# EAGLE design Pure Keys aec-pcb3-smd-Vertical-inProgress (EAGLE 9.1.1)

## Sheet 1 of 7: ATMEGA328P
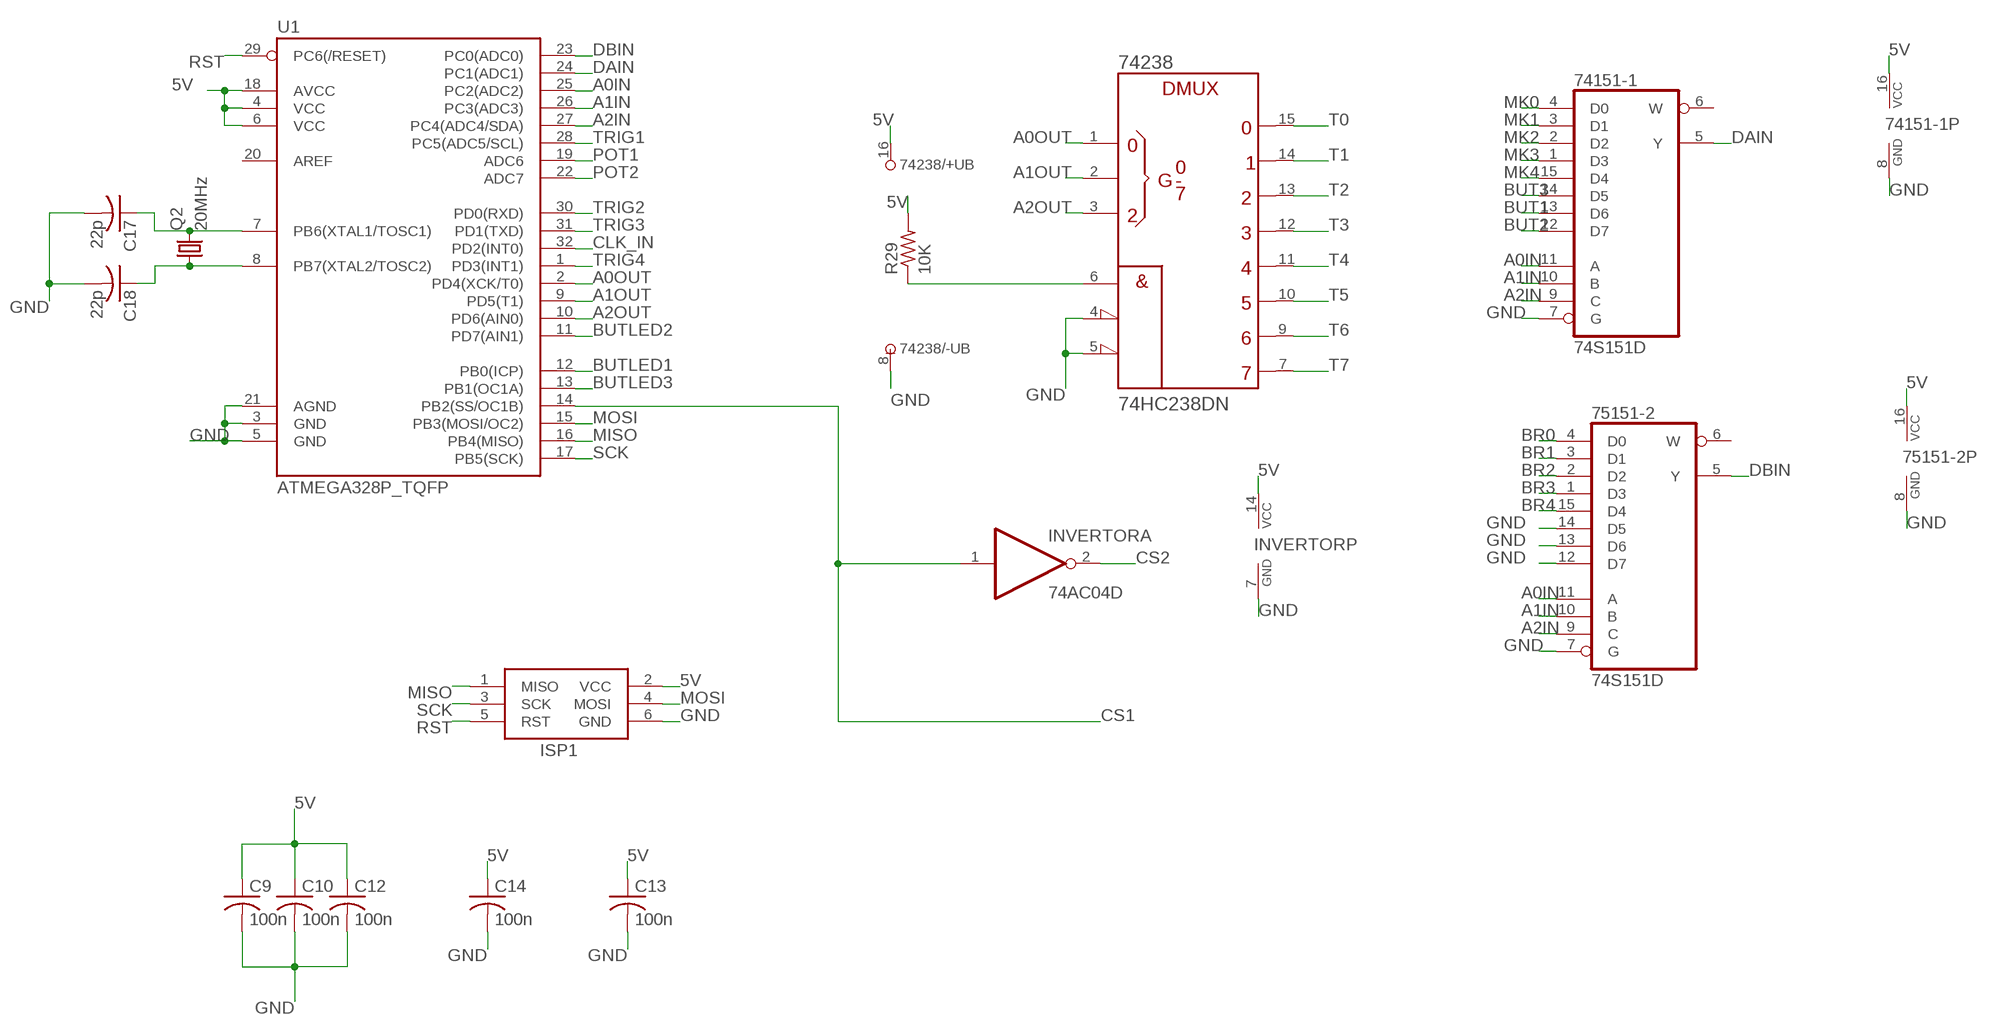
[diagram p0: schematic, sheet 1]

### Parts
74151-1  74S151D  [SO16]
74238  74HC238DN  [SO16]
75151-2  74S151D  [SO16]
C9  100n  C-USC0805K  [C0805K]
C10  100n  C-USC0805K  [C0805K]
C12  100n  C-USC0805K  [C0805K]
C13  100n  C-USC0805K  [C0805K]
C14  100n  C-USC0805K  [C0805K]
C17  22p  C-USC0805K  [C0805K]
C18  22p  C-USC0805K  [C0805K]
INVERTOR  74AC04D  [SO14]
ISP1  AVRISP-6  [AVRISP]
Q2  20MHz  CRYSTALHC49UP  [HC49UP]
R29  10K  R-US_R0805  [R0805]
U1  ATMEGA328P_TQFP  [TQFP32-08]

### Nets
5V [Power]: 74151-1.16(VCC) 74238.16(+UB) 75151-2.16(VCC) C9.1 C10.1 C12.1 C13.1 C14.1 INVERTOR.14(P:VCC) ISP1.2(VCC) R29.2 U1.4(VCC) U1.6(VCC) U1.18(AVCC) ; also sheet 2,4,5,6,7
A0IN: 74151-1.11(A) 75151-2.11(A) U1.25(PC2(ADC2))
A0OUT: 74238.1(A) U1.2(PD4(XCK/T0))
A1IN: 74151-1.10(B) 75151-2.10(B) U1.26(PC3(ADC3))
A1OUT: 74238.2(B) U1.9(PD5(T1))
A2IN: 74151-1.9(C) 75151-2.9(C) U1.27(PC4(ADC4/SDA))
A2OUT: 74238.3(C) U1.10(PD6(AIN0))
BR0: 75151-2.4(D0) ; also sheet 3
BR1: 75151-2.3(D1) ; also sheet 3
BR2: 75151-2.2(D2) ; also sheet 3
BR3: 75151-2.1(D3) ; also sheet 3
BR4: 75151-2.15(D4) ; also sheet 3
BUT1: 74151-1.13(D6) ; also sheet 6
BUT2: 74151-1.12(D7) ; also sheet 6
BUT3: 74151-1.14(D5) ; also sheet 6
BUTLED1: U1.12(PB0(ICP)) ; also sheet 6
BUTLED2: U1.11(PD7(AIN1)) ; also sheet 6
BUTLED3: U1.13(PB1(OC1A)) ; also sheet 6
CLK_IN: U1.32(PD2(INT0)) ; also sheet 7
CS1: INVERTOR.1(A:I) U1.14(PB2(SS/OC1B)) ; also sheet 5
CS2: INVERTOR.2(A:O) ; also sheet 5
DAIN: 74151-1.5(Y) U1.24(PC1(ADC1))
DBIN: 75151-2.5(Y) U1.23(PC0(ADC0))
ENOUT1: 74238.6(G1) R29.1
GND [Power]: 74151-1.7(G) 74151-1.8(GND) 74238.4(!G2A) 74238.5(!G2B) 74238.8(-UB) 75151-2.7(G) 75151-2.8(GND) 75151-2.12(D7) 75151-2.13(D6) 75151-2.14(D5) C9.2 C10.2 C12.2 C13.2 C14.2 C17.2 C18.2 INVERTOR.7(P:GND) ISP1.6(GND) U1.3(GND) U1.5(GND) U1.21(AGND) ; also sheet 2,3,4,5,6,7
MISO: ISP1.1(MISO) U1.16(PB4(MISO))
MK0: 74151-1.4(D0) ; also sheet 3
MK1: 74151-1.3(D1) ; also sheet 3
MK2: 74151-1.2(D2) ; also sheet 3
MK3: 74151-1.1(D3) ; also sheet 3
MK4: 74151-1.15(D4) ; also sheet 3
MOSI: ISP1.4(MOSI) U1.15(PB3(MOSI/OC2)) ; also sheet 5
N$10: C17.1 Q2.2 U1.7(PB6(XTAL1/TOSC1))
N$11: C18.1 Q2.1 U1.8(PB7(XTAL2/TOSC2))
POT1: U1.19(ADC6) ; also sheet 6
POT2: U1.22(ADC7) ; also sheet 6
RST: ISP1.5(RST) U1.29(PC6(/RESET))
SCK: ISP1.3(SCK) U1.17(PB5(SCK)) ; also sheet 5
T0: 74238.15(Y0) ; also sheet 3
T1: 74238.14(Y1) ; also sheet 3
T2: 74238.13(Y2) ; also sheet 3
T3: 74238.12(Y3) ; also sheet 3
T4: 74238.11(Y4) ; also sheet 3
T5: 74238.10(Y5) ; also sheet 3
T6: 74238.9(Y6) ; also sheet 3
T7: 74238.7(Y7) ; also sheet 3
TRIG1: U1.28(PC5(ADC5/SCL)) ; also sheet 4
TRIG2: U1.30(PD0(RXD)) ; also sheet 4
TRIG3: U1.31(PD1(TXD)) ; also sheet 4
TRIG4: U1.1(PD3(INT1)) ; also sheet 4
Unconnected: 74151-1.6(W) 75151-2.6(W) INVERTOR.3(B:I) INVERTOR.4(B:O) INVERTOR.5(C:I) INVERTOR.6(C:O) INVERTOR.8(D:O) INVERTOR.9(D:I) INVERTOR.10(E:O) INVERTOR.11(E:I) INVERTOR.12(F:O) INVERTOR.13(F:I) U1.20(AREF)

## Sheet 2 of 7: Power
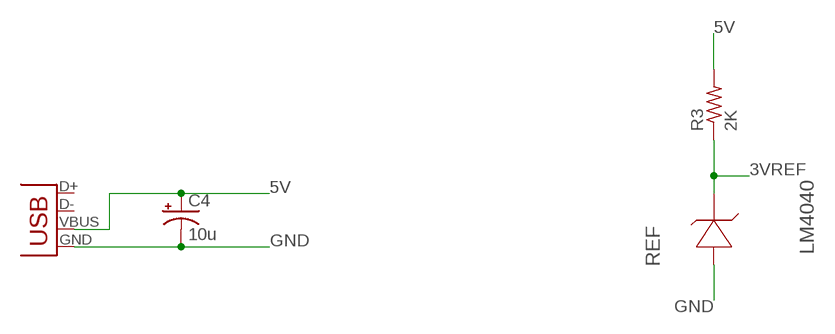
[diagram p1: schematic, sheet 2]

### Parts
C4  10u  CPOL-US153CLV-0505  [153CLV-0505]
JP2  USB-B  USBPTH  [USB-B-PTH]
R3  2K  R-US_R0805  [R0805]
REF  LM4040  LM4040A30IDBZT  [SOT95P237X112-3N]

### Nets
3VREF: R3.1 REF.1(CATHODE) ; also sheet 5
5V [Power]: C4.+ JP2.VBUS R3.2 ; also sheet 1,4,5,6,7
GND [Power]: C4.- JP2.GND REF.2(ANODE) ; also sheet 1,3,4,5,6,7
Unconnected: JP2.D+ JP2.D- REF.3(NC)

## Sheet 3 of 7: Keyboard Connector
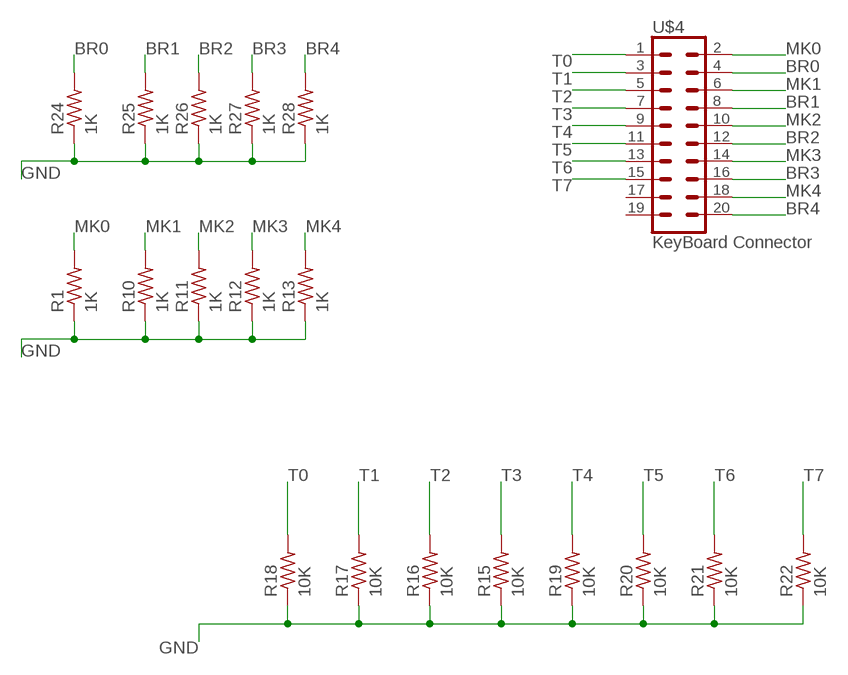
[diagram p2: schematic, sheet 3]

### Parts
R1  1K  R-US_R0805  [R0805]
R10  1K  R-US_R0805  [R0805]
R11  1K  R-US_R0805  [R0805]
R12  1K  R-US_R0805  [R0805]
R13  1K  R-US_R0805  [R0805]
R15  10K  R-US_R0805  [R0805]
R16  10K  R-US_R0805  [R0805]
R17  10K  R-US_R0805  [R0805]
R18  10K  R-US_R0805  [R0805]
R19  10K  R-US_R0805  [R0805]
R20  10K  R-US_R0805  [R0805]
R21  10K  R-US_R0805  [R0805]
R22  10K  R-US_R0805  [R0805]
R24  1K  R-US_R0805  [R0805]
R25  1K  R-US_R0805  [R0805]
R26  1K  R-US_R0805  [R0805]
R27  1K  R-US_R0805  [R0805]
R28  1K  R-US_R0805  [R0805]
U$4  KeyBoard Connector  CONN_10X2  [2X10]

### Nets
BR0: R24.2 U$4.4 ; also sheet 1
BR1: R25.2 U$4.8 ; also sheet 1
BR2: R26.2 U$4.12 ; also sheet 1
BR3: R27.2 U$4.16 ; also sheet 1
BR4: R28.2 U$4.20 ; also sheet 1
GND [Power]: R1.1 R10.1 R11.1 R12.1 R13.1 R15.1 R16.1 R17.1 R18.1 R19.1 R20.1 R21.1 R22.1 R24.1 R25.1 R26.1 R27.1 R28.1 ; also sheet 1,2,4,5,6,7
MK0: R1.2 U$4.2 ; also sheet 1
MK1: R10.2 U$4.6 ; also sheet 1
MK2: R11.2 U$4.10 ; also sheet 1
MK3: R12.2 U$4.14 ; also sheet 1
MK4: R13.2 U$4.18 ; also sheet 1
T0: R18.2 U$4.1 ; also sheet 1
T1: R17.2 U$4.3 ; also sheet 1
T2: R16.2 U$4.5 ; also sheet 1
T3: R15.2 U$4.7 ; also sheet 1
T4: R19.2 U$4.9 ; also sheet 1
T5: R20.2 U$4.11 ; also sheet 1
T6: R21.2 U$4.13 ; also sheet 1
T7: R22.2 U$4.15 ; also sheet 1
Unconnected: U$4.17 U$4.19

## Sheet 4 of 7: Triggers
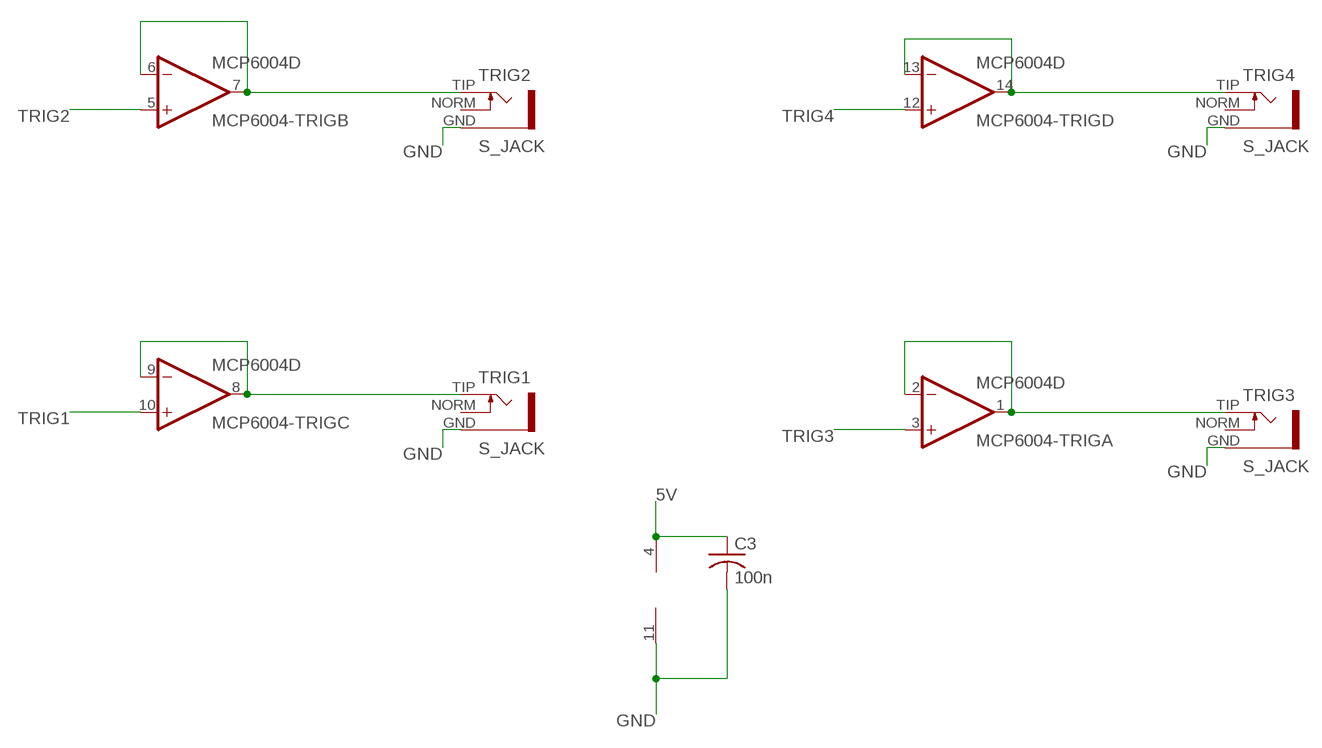
[diagram p3: schematic, sheet 4]

### Parts
C3  100n  C-USC0805K  [C0805K]
MCP6004-TRIG  MCP6004D  [SO14]
TRIG1  S_JACK  [S_JACK]
TRIG2  S_JACK  [S_JACK]
TRIG3  S_JACK  [S_JACK]
TRIG4  S_JACK  [S_JACK]

### Nets
5V [Power]: C3.1 MCP6004-TRIG.4(P:V+) ; also sheet 1,2,5,6,7
GND [Power]: C3.2 MCP6004-TRIG.11(P:V-) TRIG1.GND TRIG2.GND TRIG3.GND TRIG4.GND ; also sheet 1,2,3,5,6,7
N$3: MCP6004-TRIG.6(B:-IN) MCP6004-TRIG.7(B:OUT) TRIG2.TIP
N$4: MCP6004-TRIG.8(C:OUT) MCP6004-TRIG.9(C:-IN) TRIG1.TIP
N$5: MCP6004-TRIG.13(D:-IN) MCP6004-TRIG.14(D:OUT) TRIG4.TIP
N$6: MCP6004-TRIG.1(A:OUT) MCP6004-TRIG.2(A:-IN) TRIG3.TIP
TRIG1: MCP6004-TRIG.10(C:+IN) ; also sheet 1
TRIG2: MCP6004-TRIG.5(B:+IN) ; also sheet 1
TRIG3: MCP6004-TRIG.3(A:+IN) ; also sheet 1
TRIG4: MCP6004-TRIG.12(D:+IN) ; also sheet 1
Unconnected: TRIG1.NORM TRIG2.NORM TRIG3.NORM TRIG4.NORM

## Sheet 5 of 7: CV Out
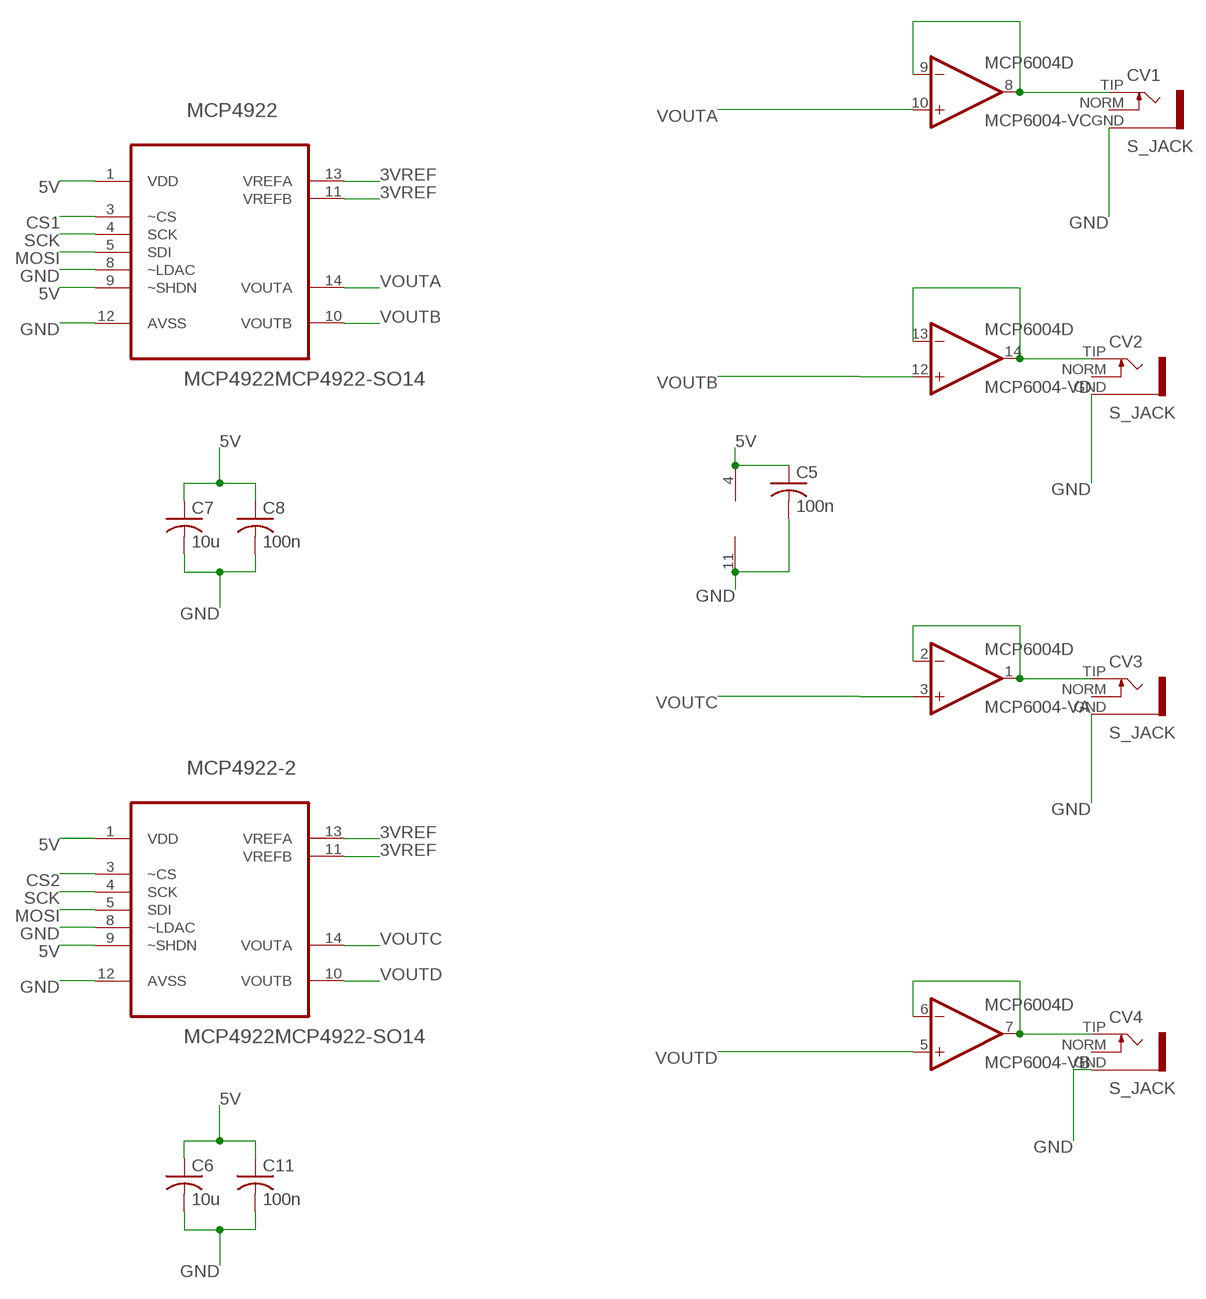
[diagram p4: schematic, sheet 5]

### Parts
C5  100n  C-USC0805K  [C0805K]
C6  10u  C-USC0805K  [C0805K]
C7  10u  C-USC0805K  [C0805K]
C8  100n  C-USC0805K  [C0805K]
C11  100n  C-USC0805K  [C0805K]
CV1  S_JACK  [S_JACK]
CV2  S_JACK  [S_JACK]
CV3  S_JACK  [S_JACK]
CV4  S_JACK  [S_JACK]
MCP4922  MCP4922MCP4922-SO14  [SO14]
MCP4922-2  MCP4922MCP4922-SO14  [SO14]
MCP6004-V  MCP6004D  [SO14]

### Nets
3VREF: MCP4922-2.11(VREFB) MCP4922-2.13(VREFA) MCP4922.11(VREFB) MCP4922.13(VREFA) ; also sheet 2
5V [Power]: C5.1 C6.1 C7.1 C8.1 C11.1 MCP4922-2.1(VDD) MCP4922-2.9(~SHDN) MCP4922.1(VDD) MCP4922.9(~SHDN) MCP6004-V.4(P:V+) ; also sheet 1,2,4,6,7
CS1: MCP4922.3(~CS) ; also sheet 1
CS2: MCP4922-2.3(~CS) ; also sheet 1
GND [Power]: C5.2 C6.2 C7.2 C8.2 C11.2 CV1.GND CV2.GND CV3.GND CV4.GND MCP4922-2.8(~LDAC) MCP4922-2.12(AVSS) MCP4922.8(~LDAC) MCP4922.12(AVSS) MCP6004-V.11(P:V-) ; also sheet 1,2,3,4,6,7
MOSI: MCP4922-2.5(SDI) MCP4922.5(SDI) ; also sheet 1
N$7: CV1.TIP MCP6004-V.8(C:OUT) MCP6004-V.9(C:-IN)
N$25: CV4.TIP MCP6004-V.6(B:-IN) MCP6004-V.7(B:OUT)
N$31: CV3.TIP MCP6004-V.1(A:OUT) MCP6004-V.2(A:-IN)
N$36: CV2.TIP MCP6004-V.13(D:-IN) MCP6004-V.14(D:OUT)
SCK: MCP4922-2.4(SCK) MCP4922.4(SCK) ; also sheet 1
VOUTA: MCP4922.14(VOUTA) MCP6004-V.10(C:+IN)
VOUTB: MCP4922.10(VOUTB) MCP6004-V.12(D:+IN)
VOUTC: MCP4922-2.14(VOUTA) MCP6004-V.3(A:+IN)
VOUTD: MCP4922-2.10(VOUTB) MCP6004-V.5(B:+IN)
Unconnected: CV1.NORM CV2.NORM CV3.NORM CV4.NORM

## Sheet 6 of 7: Pots and Buttons
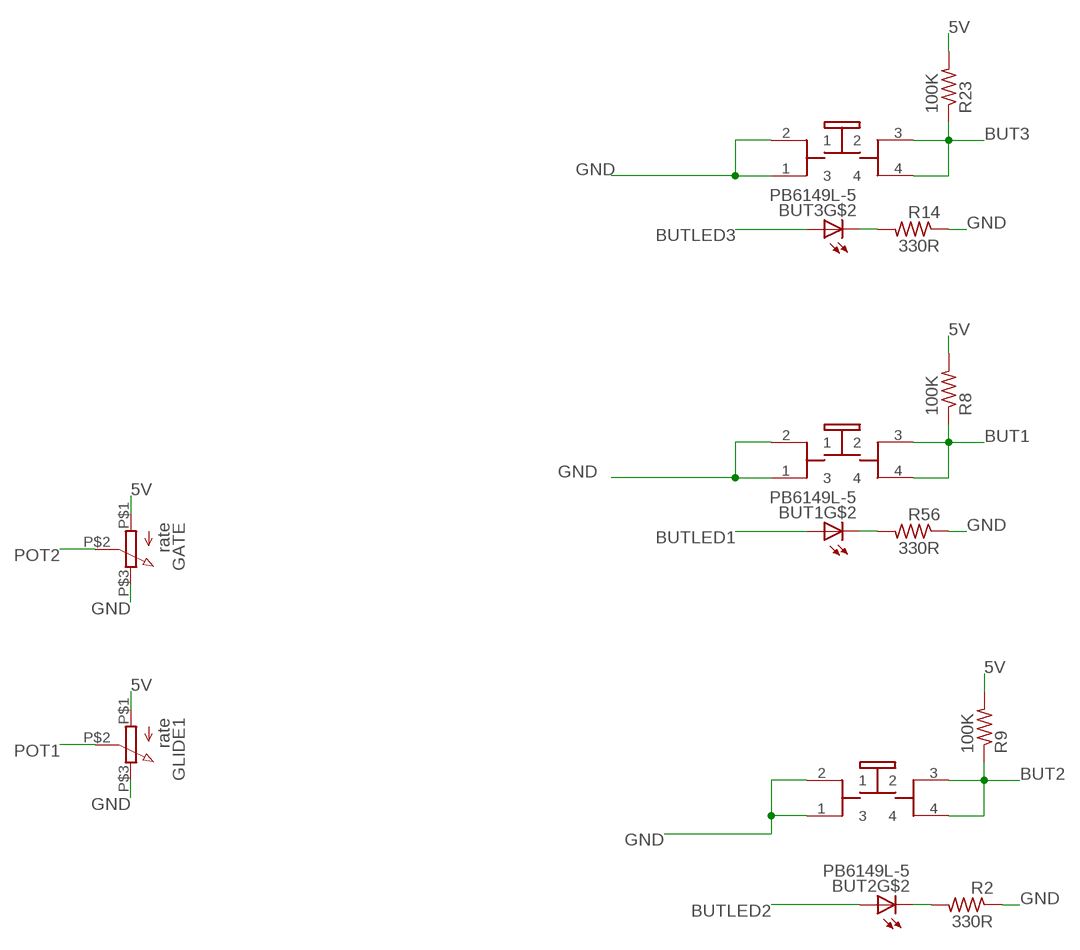
[diagram p5: schematic, sheet 6]

### Parts
BUT1  PB6149L-5  [PB6149L]
BUT2  PB6149L-5  [PB6149L]
BUT3  PB6149L-5  [PB6149L]
GATE  rate  9MMPOT  [POT]
GLIDE1  rate  9MMPOT  [POT]
R2  330R  R-US_R0805  [R0805]
R8  100K  R-US_R0805  [R0805]
R9  100K  R-US_R0805  [R0805]
R14  330R  R-US_R0805  [R0805]
R23  100K  R-US_R0805  [R0805]
R56  330R  R-US_R0805  [R0805]

### Nets
5V [Power]: GATE.P$1 GLIDE1.P$1 R8.2 R9.2 R23.2 ; also sheet 1,2,4,5,7
BUT1: BUT1.3 BUT1.4 R8.1 ; also sheet 1
BUT2: BUT2.3 BUT2.4 R9.1 ; also sheet 1
BUT3: BUT3.3 BUT3.4 R23.1 ; also sheet 1
BUTLED1: BUT1.A ; also sheet 1
BUTLED2: BUT2.A ; also sheet 1
BUTLED3: BUT3.A ; also sheet 1
GND [Power]: BUT1.1 BUT1.2 BUT2.1 BUT2.2 BUT3.1 BUT3.2 GATE.P$3 GLIDE1.P$3 R2.1 R14.1 R56.1 ; also sheet 1,2,3,4,5,7
N$1: BUT3.K(C) R14.2
N$8: BUT2.K(C) R2.2
N$65: BUT1.K(C) R56.2
POT1: GLIDE1.P$2 ; also sheet 1
POT2: GATE.P$2 ; also sheet 1

## Sheet 7 of 7: Clock
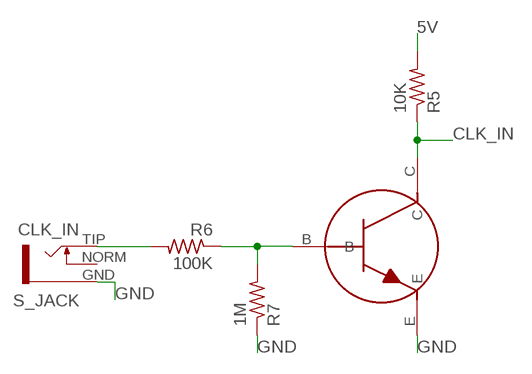
[diagram p6: schematic, sheet 7]

### Parts
CLK_IN  S_JACK  [S_JACK]
CLOCK  2N3904  TRANSISTOR_MMBT3904  [TRANSISTOR_SINGLE_N-TYPE]
R5  10K  R-US_R0805  [R0805]
R6  100K  R-US_R0805  [R0805]
R7  1M  R-US_R0805  [R0805]

### Nets
5V [Power]: R5.2 ; also sheet 1,2,4,5,6
CLK_IN: CLOCK.C R5.1 ; also sheet 1
GND [Power]: CLK_IN.GND CLOCK.E R7.1 ; also sheet 1,2,3,4,5,6
N$17: CLOCK.B R6.1 R7.2
N$26: CLK_IN.TIP R6.2
Unconnected: CLK_IN.NORM

## Library data of the parts
74151-1 75151-2 = 74xx-eu:74*151: Data SELECTOR/MULTIPLEXER
74238 = GMSN-R2Project:74HC238D: 1 of 8 noninverting DECODER/DEMULTIPLEXER
BUT1-BUT3 = INSTRUO:PB6149L-5
C3 C5-C14 C17 C18 = rcl:C-US: CAPACITOR, American symbol
C4 = rcl:CPOL-US: POLARIZED CAPACITOR, American symbol
CLK_IN CV1-CV4 TRIG1-TRIG4 = INSTRUO:S_JACK
CLOCK = INSTRUO:TRANSISTOR_MMBT3904
GATE GLIDE1 = GMSN:9MMPOT
INVERTOR = 74xx-eu:74*04: Hex INVERTER
ISP1 = adafruit:AVRISP: AVR ISP HEADER Standard 6 pin header for AVR programming
JP2 = SparkFun-Connectors:USB: USB Connectors USB-B-PTH is fully proven SKU : PRT-00139/CONN-08278 USB-miniB is fully proven SKU : PRT-00587 USB-A-PCB is untested. USB-A-H is throughly reviewed, but untested. Spark Fun Electronics SKU : PRT-00437 USB-B-SMT is throughly reviewed, but untested. Needs silkscreen touching up. USB-A-S has not been used/tested USB-MB-H has not been used/tested USB-MICROB has been used. CONN-09505; PROD_ID: CONN-08278
MCP4922 MCP4922-2 = GMSN-R2Project:MCP4922
MCP6004-TRIG MCP6004-V = GMSN-R2Project:MCP6004: OP AMP
Q2 = adafruit:CRYSTAL: CRYSTAL; OC_FARNELL: unknown; OC_NEWARK: unknown
R1 R10-R13 R24-R28 = rcl:R-US_: RESISTOR, American symbol; RS-PART: 223-0427
R2 R3 R5-R9 R14-R23 R29 R56 = rcl:R-US_: RESISTOR, American symbol
REF = GMSN-R2Project:LM4040A30IDBZT: PRECISION MICROPOWER SHUNT VOLTAGE REFERENCE; MPN: LM4040A30IDBZT; OC_FARNELL: 1755108; OC_NEWARK: 58K5870; PACKAGE: 3-SOT-23; RS-PART: 809-6343; SUPPLIER: TEXAS INSTRUMENTS
U1 = SparkFun-IC-Microcontroller:ATMEGA328P_TQFP: Popular 328P in QFP Storefront component: ATmega328 - TQFP <https://www.sparkfun.com/products/13448> (COM-13448) Datasheet <http://www.sparkfun.com/datasheets/Components/SMD/ATMega328.pdf> SparkFun Products SparkFun RedBoard - Programmed with Arduino <https://www.sparkfun.com/products/12757> (DEV-12757) Arduino Pro Mini 328 - 5V/16MHz <https://www.sparkfun.com/products/11113> (DEV-11113) Arduino Pro Mini 328 - 3.3V/8MHz <https://www.sparkfun.com/products/11114> (DEV-11114) SparkFun OpenLog <https://www.sparkfun.com/products/13712> (DEV-13712) SparkFun MicroView - OLED Arduino Module <https://www.sparkfun.com/products/12923> (DEV-12923) SparkFun Digital Sandbox <https://www.sparkfun.com/products/12651> (DEV-12651) SparkFun PicoBoard <https://www.sparkfun.com/products/11888> (WIG-11888) Arduino Fio <https://www.sparkfun.com/products/10116> (DEV-10116) LilyPad Arduino 328 Main Board <https://www.sparkfun.com/products/13342> (DEV-13342) SparkFun RedStick <https://www.sparkfun.com/products/13741> (DEV-13741) LilyPad MP3 <https://www.sparkfun.com/products/11013> (DEV-11013) LilyPad Arduino SimpleSnap <https://www.sparkfun.com/products/10941> (DEV-10941) SparkFun Stepoko <https://www.sparkfun.com/products/13899> (ROB-13899) SparkFun Geiger Counter <https://www.sparkfun.com/products/11345> (SEN-11345) SparkFun EL Sequencer <https://www.sparkfun.com/products/12781> (COM-12781) Arduino Pro 328 - 5V/16MHz <https://www.sparkfun.com/products/10915> (DEV-10915) CryptoCape <https://www.sparkfun.com/products/12773> (DEV-12773) SparkFun IR Thermometer Evaluation Board - MLX90614 <https://www.sparkfun.com/products/10740> (SEN-10740) SparkFun RedBot Mainboard <https://www.sparkfun.com/products/12097> (ROB-12097) Arduino Pro 328 - 3.3V/8MHz <https://www.sparkfun.com/products/10914> (DEV-10914) SparkFun Block for Intel® Edison - Arduino <https://www.sparkfun.com/products/13036> (DEV-13036) SparkFun Simon Says - Surface Mount Soldering Kit <https://www.sparkfun.com/products/10935> (KIT-10935) SparkFun 7-Segment Serial Display - Red <https://www.sparkfun.com/products/11441> (COM-11441) SparkFun 7-Segment Serial Display - White <https://www.sparkfun.com/products/11629> (COM-11629) SparkFun 7-Segment Serial Display - Yellow <https://www.sparkfun.com/products/11443> (COM-11443) SparkFun 7-Segment Serial Display - Kelly Green <https://www.sparkfun.com/products/11440> (COM-11440) SparkFun 7-Segment Serial Display - Blue <https://www.sparkfun.com/products/11442> (COM-11442) SparkFun OpenSegment Serial Display - 20mm (Blue) <https://www.sparkfun.com/products/11647> (COM-11647) SparkFun OpenSegment Serial Display - 20mm (Green) <https://www.sparkfun.com/products/11646> (COM-11646) SparkFun OpenSegment Serial Display - 20mm (White) <https://www.sparkfun.com/products/11648> (COM-11648) SparkFun OpenSegment Serial Display - 20mm (Red) <https://www.sparkfun.com/products/11644> (COM-11644) SparkFun OpenSegment Serial Display - 20mm (Yellow) <https://www.sparkfun.com/products/11645> (COM-11645) SparkFun OpenSegment Shield <https://www.sparkfun.com/products/13190> (DEV-13190); PROD_ID: IC-09069
U$4 = SparkFun-Connectors:CONN_10X2: Multi connection point. Often used as Generic Header-pin footprint for 0.1 inch spaced/style header connections On any of the 0.1 inch spaced packages, you can populate with these: Break Away Headers - Straight <https://www.sparkfun.com/products/116> (PRT-00116) Break Away Male Headers - Right Angle <https://www.sparkfun.com/products/553> (PRT-00553) Female Headers <https://www.sparkfun.com/products/115> (PRT-00115) Break Away Headers - Machine Pin <https://www.sparkfun.com/products/117> (PRT-00117) Break Away Female Headers - Swiss Machine Pin <https://www.sparkfun.com/products/743> (PRT-00743); RS-PART: 669-5364

## Net classes
1 Power: width 0.61 mm

## Board
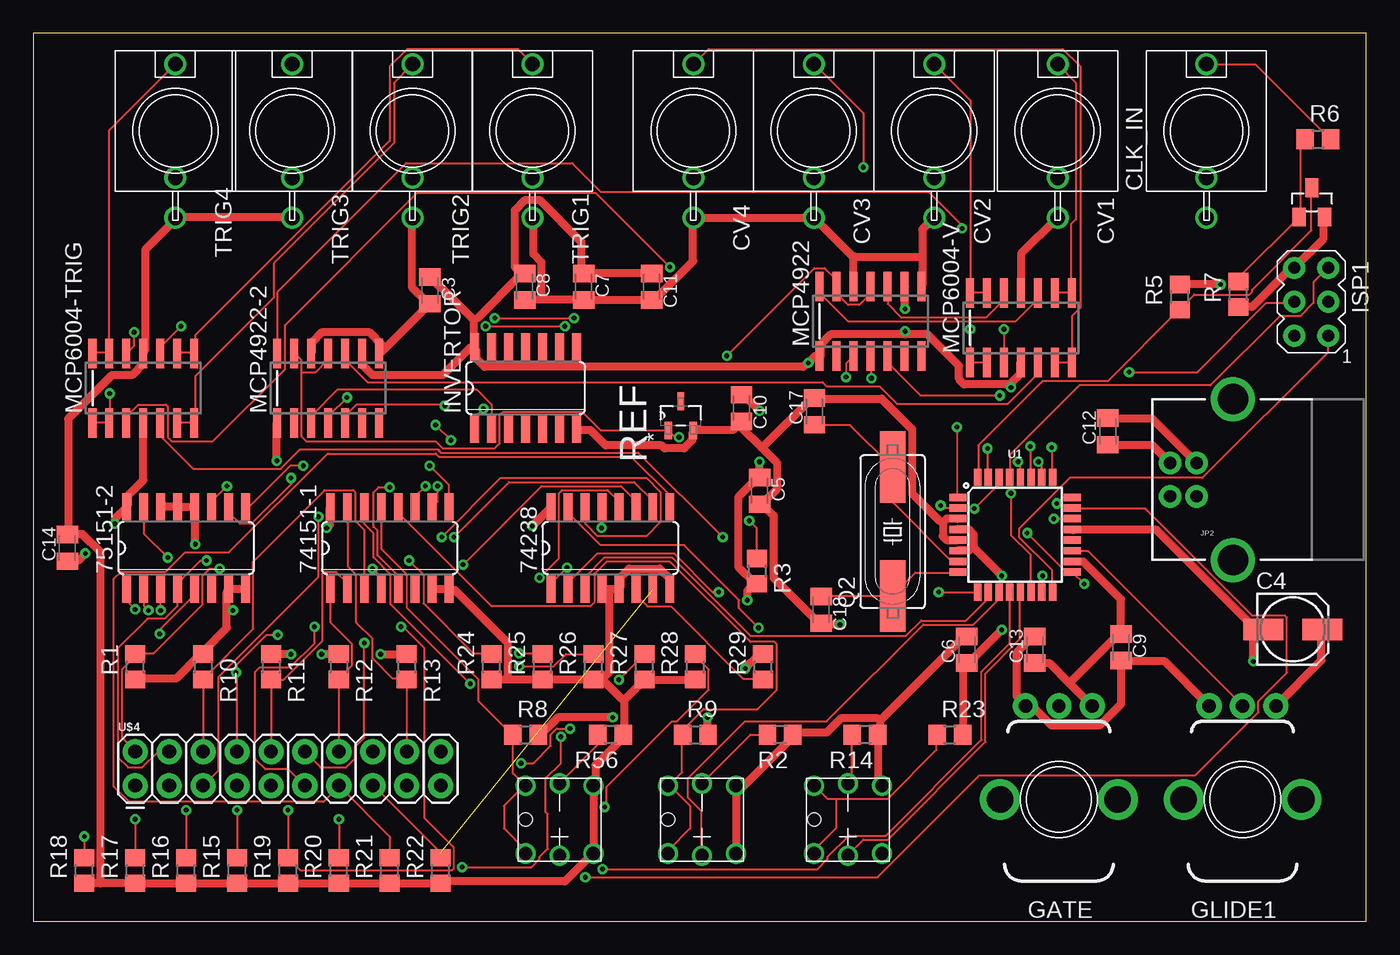
[diagram p7: board, top side]
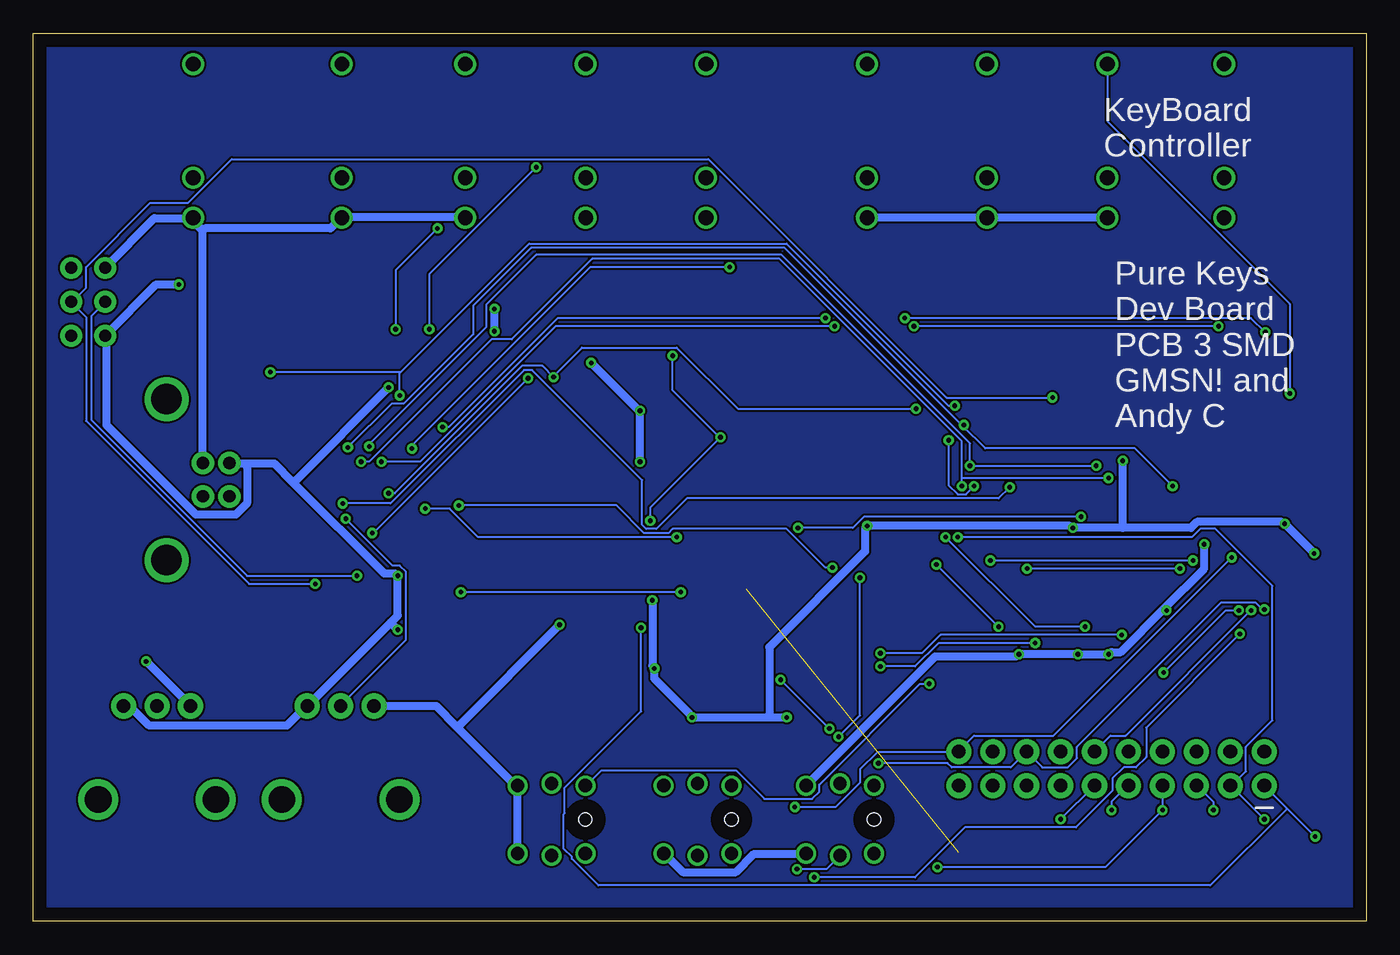
[diagram p8: board, bottom side, seen from below]

Size 99.73 x 66.43 mm. Coordinates in mm from the lower left corner, seen from the top.
Outline: 0,0 99.73,0 99.73,66.43 0,66.43 0,0
Copper layers (1*16): Top 0.035mm / dielectric 1.5mm / Bottom 0.035mm
Design rules "default": minimum track width 6mil, minimum drill 0.35mm, track to track 6mil, track to pad 6mil, pad to pad 6mil, via to via 6mil, smd to smd 6mil, copper to edge 40mil, drill to drill 6mil, minimum pad ring 10mil, minimum via ring 8mil, stop-mask expansion 4mil, vias tented up to drill 0mil, thermal gap 10mil

### Footprints (pad centres in the part's own frame; a part is rotated, then mirrored left to right if it is on the bottom)
SO16 = smd 0.66 x 2.032: 1 -4.445,-3.073; 2 -3.175,-3.073; 3 -1.905,-3.073; 4 -0.635,-3.073; 5 0.635,-3.073; 6 1.905,-3.073; 7 3.175,-3.073; 8 4.445,-3.073; 9 4.445,3.073; 10 3.175,3.073; 11 1.905,3.073; 12 0.635,3.073; 13 -0.635,3.073; 14 -1.905,3.073; 15 -3.175,3.073; 16 -4.445,3.073
PB6149L = drill 1: 1 2.54,-2.54; 2 2.54,2.54; 3 -2.54,-2.54; 4 -2.54,2.54; A 0,-2.7; K 0,2.7 | hole 1: -2.54,0
C0805K = smd 1.3 x 1.6: 1 -1,0; 2 1,0
153CLV-0505 = smd 3 x 1.6: + 2.2,0; - -2.2,0
S_JACK = drill 1.1: GND 0,-6.5; NORM 0,-3.5; TIP 0,5
TRANSISTOR_SINGLE_N-TYPE = smd 1 x 1.4: B -0.95,-1.1; C 0,1.1; E 0.95,-1.1
POT = drill 1 pad 1.88: P$1 -2.5,-7; P$2 0,-7; P$3 2.5,-7 | drill 2 pad 2.68: P$4 -4.4,0; P$5 4.4,0
SO14 = smd 0.66 x 2.032: 1 -3.81,-3.073; 2 -2.54,-3.073; 3 -1.27,-3.073; 4 0,-3.073; 5 1.27,-3.073; 6 2.54,-3.073; 7 3.81,-3.073; 8 3.81,3.073; 9 2.54,3.073; 10 1.27,3.073; 11 0,3.073; 12 -1.27,3.073; 13 -2.54,3.073; 14 -3.81,3.073
AVRISP = drill 0.9 pad 1.626: 1 -1.27,2.54; 2 1.27,2.54; 3 -1.27,0; 4 1.27,0; 5 -1.27,-2.54; 6 1.27,-2.54
USB-B-PTH = drill 0.914 pad 1.676: D+ 0,1.25; D- 1.981,1.25; GND 0,-1.25; VBUS 1.981,-1.25 | drill 2.286: S1 -2.718,-6.02; S2 -2.718,6.02
SO14' = smd 0.6 x 2.2: 1 -3.81,-2.6; 2 -2.54,-2.6; 3 -1.27,-2.6; 4 0,-2.6; 5 1.27,-2.6; 6 2.54,-2.6; 7 3.81,-2.6; 8 3.81,2.6; 9 2.54,2.6; 10 1.27,2.6; 11 0,2.6; 12 -1.27,2.6; 13 -2.54,2.6; 14 -3.81,2.6
HC49UP = smd 5.334 x 1.93: 1 -4.826,0; 2 4.826,0
R0805 = smd 1.3 x 1.5: 1 -0.95,0; 2 0.95,0
SOT95P237X112-3N = smd 1.321 x 0.559: 1 -1.092,0.94; 2 -1.092,-0.94 | smd 1.321 x 0.508: 3 1.092,0
TQFP32-08 = smd 1.27 x 0.559: 1 -4.293,2.8; 2 -4.293,2; 3 -4.293,1.2; 4 -4.293,0.4; 5 -4.293,-0.4; 6 -4.293,-1.2; 7 -4.293,-2; 8 -4.293,-2.8; 17 4.293,-2.8; 18 4.293,-2; 19 4.293,-1.2; 20 4.293,-0.4; 21 4.293,0.4; 22 4.293,1.2; 23 4.293,2; 24 4.293,2.8 | smd 0.559 x 1.27: 9 -2.8,-4.293; 10 -2,-4.293; 11 -1.2,-4.293; 12 -0.4,-4.293; 13 0.4,-4.293; 14 1.2,-4.293; 15 2,-4.293; 16 2.8,-4.293; 25 2.8,4.293; 26 2,4.293; 27 1.2,4.293; 28 0.4,4.293; 29 -0.4,4.293; 30 -1.2,4.293; 31 -2,4.293; 32 -2.8,4.293
2X10 = drill 1.016 pad 1.88: 1 0,0; 2 0,2.54; 3 2.54,0; 4 2.54,2.54; 5 5.08,0; 6 5.08,2.54; 7 7.62,0; 8 7.62,2.54; 9 10.16,0; 10 10.16,2.54; 11 12.7,0; 12 12.7,2.54; 13 15.24,0; 14 15.24,2.54; 15 17.78,0; 16 17.78,2.54; 17 20.32,0; 18 20.32,2.54; 19 22.86,0; 20 22.86,2.54

### Placement (x,y rotation side)
74151-1  26.67,27.94 0 top
74238  43.18,27.94 0 top
75151-2  11.43,27.94 0 top
BUT1  39.37,7.62 0 top
BUT2  50.03,7.62 0 top
BUT3  60.96,7.62 0 top
C3  29.67,47.21 270 top
C4  94.24,21.85 0 top
C5  54.35,32.21 270 top
C6  69.85,20.32 90 top
C7  41.18,47.48 270 top
C8  36.76,47.48 270 top
C9  81.39,20.51 270 top
C10  52.99,38.4 270 top
C11  46.27,47.48 270 top
C12  80.39,36.66 90 top
C13  74.93,20.32 90 top
C14  2.54,27.94 90 top
C17  58.45,38.16 90 top
C18  58.95,23.31 270 top
CLK_IN  87.78,59.14 0 top
CLOCK  95.67,53.79 0 top
CV1  76.65,59.14 0 top
CV2  67.41,59.14 0 top
CV3  58.4,59.14 0 top
CV4  49.39,59.14 0 top
GATE  76.74,9.12 180 top
GLIDE1  90.48,9.12 180 top
INVERTOR  36.83,39.9 0 top
ISP1  95.63,46.35 180 top
JP2  87.05,33.05 180 top
MCP4922  MCP4922MCP4922-SO14  [SO14']  62.65,44.9 0 top
MCP4922-2  MCP4922MCP4922-SO14  [SO14']  22.05,39.9 0 top
MCP6004-TRIG  MCP6004D  [SO14']  8.23,39.9 0 top
MCP6004-V  MCP6004D  [SO14']  73.89,44.4 0 top
Q2  64.3,29.16 90 top
R1  7.62,19.05 90 top
R2  55.88,13.97 180 top
R3  54.16,26.21 270 top
R5  85.78,46.71 90 top
R6  96.12,58.52 0 top
R7  90.17,46.91 90 top
R8  36.83,13.97 0 top
R9  49.53,13.97 0 top
R10  12.7,19.05 270 top
R11  17.78,19.05 270 top
R12  22.86,19.05 270 top
R13  27.94,19.05 270 top
R14  62.23,13.97 180 top
R15  15.24,3.81 90 top
R16  11.43,3.81 90 top
R17  7.62,3.81 90 top
R18  3.81,3.81 90 top
R19  19.05,3.81 90 top
R20  22.86,3.81 90 top
R21  26.67,3.81 90 top
R22  30.48,3.81 90 top
R23  68.58,13.97 0 top
R24  34.29,19.05 90 top
R25  38.1,19.05 90 top
R26  41.91,19.05 90 top
R27  45.72,19.05 90 top
R28  49.53,19.05 90 top
R29  54.61,19.05 90 top
R56  43.18,13.97 180 top
REF  48.44,37.82 90 top
TRIG1  37.34,59.14 0 top
TRIG2  28.37,59.14 0 top
TRIG3  19.36,59.14 0 top
TRIG4  10.62,59.14 0 top
U1  73.46,28.93 0 top
U$4  7.62,10.16 0 top

### Tracks (layer width: path | path; a pad name or v marks a point on that pad's centre or on a via)
3VREF  (via drill 0.35)
  Top 0.152: MCP4922.11 62.64,47.5 62.64,46.97 61.8,46.13 60.96,46.13 60.12,46.97 60.12,47.5 MCP4922.13 60.05,47.57 60.05,48.03 59.21,48.87 58.45,48.87 v51.89,42.32 | 20.04,41.1 20.04,42.01 19.58,42.47 MCP4922-2.13 | 20.04,41.1 20.04,36.3 20.42,35.92 30.1,35.92 30.63,35.38 34.52,35.38 34.9,35.76 34.9,37.9 35.13,38.12 41.07,38.12 42.44,36.75 47.47,36.75 REF.1 47.55,36.68 48.01,36.22 v48.31,36.22 | v53.57,29.97 54.1,29.44 54.1,27.23 R3.1 | 20.04,41.1 21.11,41.1 22.02,42.01 22.02,42.47 MCP4922-2.11
  Bottom 0.152: v53.57,29.97 53.57,30.96 v48.31,36.22 48.39,36.22 51.89,39.73 v51.89,42.32
5V  (via drill 0.35)
  Top 0.61: v43.36,15.26 39.24,15.26 37.95,13.97 37.8,13.97 R8.2 | v50.44,15.26 50.44,13.97 R9.2 | v53.26,18.92 54.33,19.99 54.56,19.99 R29.2 | v3.89,27.53 3.35,27 2.59,27 C14.1 | v6.1,29.74 6.1,30.12 6.93,30.96 75151-2.16 7.09,31.27 7.09,31.88 8.23,33.02 8.23,37.29 MCP6004-TRIG.4 | v21.95,29.44 22.17,29.67 22.17,30.96 74151-1.16 | v37.34,29.59 38.71,30.96 74238.16 | v18.21,34.47 18.21,37.29 MCP4922-2.1 | v88.85,47.65 85.8,47.65 R5.2 | C4.+ 96.39,21.82 96.39,19.53 93.04,16.18 GLIDE1.P$1 | C12.1 80.39,35.61 83.74,35.61 85.04,34.31 JP2.VBUS | U1.18 77.8,26.92 78.56,26.92 81.38,24.1 C9.1 81.15,21.29 81,21.29 77.72,18.01 77.53,17.82 | R23.2 69.57,13.97 69.57,19.07 69.8,19.3 C6.1 70.1,19.46 v72.47,21.82 | 70.29,28.03 70.33,28.07 70.33,28.98 69.95,29.36 69.19,29.36 U1.4 | 70.29,28.03 70.03,27.76 69.19,27.76 U1.6 | 77.53,17.82 79.17,16.18 GATE.P$1 | 77.53,17.82 76.05,19.3 74.98,19.3 C13.1 | v72.47,25.86 70.48,27.84 70.29,28.03 | C11.1 46.25,48.49 41.22,48.49 C7.1 41,48.72 41,50.85 37.87,53.98 36.8,53.98 36.04,53.21 36.04,48.95 36.35,48.64 C8.1 36.73,48.41 36.5,48.41 33.22,45.14 32.99,44.98 | 32.99,44.98 30.63,47.35 30.56,47.35 29.72,48.18 C3.1 | 32.99,43 32.99,44.98 | 32.99,43 INVERTOR.14 33.15,42.7 33.15,42.09 33.76,41.48 57.61,41.48 57.76,41.63 v57.99,41.78 58.52,42.32 MCP4922.1 58.9,42.32 58.9,43.16 59.66,43.92 65.23,43.92 | MCP4922-2.9 24.61,42.47 24.61,41.63 25.38,40.87 30.63,40.87 32.69,42.93 32.99,43 | v54.33,38.2 53.19,39.34 53.03,39.34 C10.1 | v54.33,34.39 54.33,33.48 C5.1 54.33,33.17 54.18,33.17 52.73,31.73 52.73,26.54 53.95,25.32 54.1,25.32 R3.2 53.8,25.09 53.42,24.71 v53.42,24.03
  Top 0.61: 65.23,43.92 66.9,43.92 69.27,41.55 69.27,40.56 69.65,40.18 73.08,40.18 | 73.08,40.18 73.84,40.95 73.84,41.78 MCP6004-V.4 | v65.23,45.82 65.23,47.5 MCP4922.9 | v65.23,44.15 65.23,43.92 | v73.15,39.95 73.08,40.18
  Bottom 0.61: 44.65,15.26 v50.44,15.26 50.6,15.49 53.26,18.16 v53.26,18.92 53.42,19.15 v53.42,24.03 | 44.65,15.26 v43.36,15.26 | v3.89,27.53 v6.1,29.74 6.33,29.9 12.65,29.9 13.11,29.44 18.21,29.44 | 18.21,29.44 v21.95,29.44 22.17,29.59 v37.34,29.59 37.49,29.36 37.49,27.69 44.65,20.52 44.65,15.49 44.65,15.26 | v18.21,34.47 18.21,29.67 18.21,29.44 | v88.85,47.65 90.53,47.65 94.34,43.84 ISP1.2 94.26,43.54 94.26,37.13 87.55,30.43 84.58,30.43 83.74,31.27 83.74,34.01 83.74,34.24 | 73,22.35 79.17,16.18 GATE.P$1 79.48,15.95 80.77,14.66 91.06,14.66 92.51,16.1 92.96,16.1 GLIDE1.P$1 | 73,22.35 72.47,22.88 v72.47,25.86 72.69,26.01 73.46,26.01 80.28,32.83 | v72.47,21.82 72.85,22.2 73,22.35 | 83.74,34.24 81.69,34.24 80.28,32.83 | 83.74,34.24 85.04,34.24 JP2.VBUS | v54.33,34.39 v54.33,38.2 54.56,38.35 v57.99,41.78 | v65.23,44.15 v65.23,45.82 | v73.15,39.95 80.09,33.02 80.28,32.83
A0IN  (via drill 0.35)
  Top 0.152: v76.2,35.46 76.2,33.25 U1.25 | v14.48,32.56 13.34,31.42 13.34,31.04 75151-2.11 | v29.34,32.56 28.57,31.8 28.57,31.04 74151-1.11 | v30.1,37.13 v31.24,35.99
  Bottom 0.152: v76.2,35.46 72.92,38.73 72.01,38.73 66.83,43.92 66.83,46.05 62.48,50.39 43.51,50.39 30.21,37.1 | 30.21,37.1 28.5,35.38 17.3,35.38 v14.48,32.56 | v29.34,32.56 29.95,31.95 30.56,31.95 31.24,32.64 v31.24,35.99 | v30.1,37.13 30.18,37.13 30.21,37.1
A0OUT  (via drill 0.35)
  Top 0.152: v67.89,31.12 68.05,30.96 69.11,30.96 U1.2 | v39.93,26.47 38.79,25.32 38.79,24.87 74238.1
  Bottom 0.152: v67.89,31.12 56.08,31.12 54.03,29.06 52.2,29.06 51.89,29.36 43.36,29.36 40.46,26.47 v39.93,26.47
A1IN  (via drill 0.35)
  Top 0.152: v75.21,34.39 75.44,34.16 75.44,33.25 U1.26 | v30.25,32.56 30.25,31.42 29.87,31.04 74151-1.10 | v19.28,33.17 19.28,32.71 16.31,29.74 15.47,29.74 14.63,30.58 14.63,30.96 75151-2.10
  Bottom 0.152: v75.21,34.39 74.6,34.39 65.46,43.54 63.93,43.54 57.91,49.55 43.89,49.55 30.25,35.92 30.25,33.17 | v30.25,32.56 30.25,33.17 | 30.25,33.17 v19.28,33.17
A1OUT  (via drill 0.35)
  Top 0.152: v67.74,24.64 70.64,24.64 U1.9 | v51.28,24.64 50.83,24.64 47.93,27.53 42.22,27.53 40.01,25.32 74238.2
  Bottom 0.152: v51.28,24.64 v67.74,24.64
A2IN  (via drill 0.35)
  Top 0.152: v74.6,35.53 74.6,33.25 U1.27 | v29.64,34.09 31.09,32.64 31.09,31.04 74151-1.9 | v20.19,34.09 19.2,34.09 16.15,31.04 15.93,31.04 75151-2.9
  Bottom 0.152: v74.6,35.53 74.6,35.69 65.84,44.45 65.84,46.13 62.1,49.86 43.74,49.86 29.64,35.76 v29.64,34.09 v20.19,34.09
A2OUT
  Top 0.152: U1.10 71.4,24.56 71.4,24.1 69.8,22.5 66.45,22.5 65.3,21.36 53.65,21.36 47.78,27.23 42.75,27.23 41.3,25.78 41.3,24.87 74238.3
BR0  (via drill 0.35)
  Top 0.152: v28.12,27 29.18,25.93 29.18,23.8 32.92,20.07 34.29,20.07 R24.2 | v12.95,27 12.5,27 10.82,25.32 10.82,24.87 75151-2.4 10.74,24.87 10.74,23.57 9.83,22.66 8.53,22.66 6.33,20.45 6.33,12.29 7.09,11.53 8.15,11.53 9.3,12.68 10.13,12.68 U$4.4
  Bottom 0.152: v12.95,27 v28.12,27
BR1  (via drill 0.35)
  Top 0.152: v36.35,20.07 38.1,20.07 R25.2 | v18.29,21.44 17.45,21.44 15.24,19.23 15.24,18.62 | 15.24,18.62 15.24,12.75 U$4.8 | v9.53,23.27 75151-2.3 | 15.24,18.62 v15.16,18.62
  Bottom 0.152: v36.35,20.07 33.22,20.07 31.85,21.44 v18.29,21.44 | v9.53,23.27 10.52,23.27 v15.16,18.62
BR2  (via drill 0.35)
  Top 0.152: v36.35,19.07 38.94,19.07 39.85,19.99 R26.2 | v24.77,20.83 24.77,13.74 24.08,13.06 24.08,12.22 23.39,11.53 21.49,11.53 20.34,12.68 U$4.12 | v8.61,23.27 8.31,23.57 8.31,24.87 75151-2.2
  Bottom 0.152: v36.35,19.07 33.76,19.07 32,20.83 v24.77,20.83 | v8.61,23.27 17.98,13.89 19.13,13.89 20.27,12.75 U$4.12
BR3  (via drill 0.35)
  Top 0.152: v43.81,18.09 R27.2 | v40.16,14.43 39.17,14.43 38.71,13.97 38.71,13.13 37.41,11.84 v36.5,11.84 | v7.62,23.34 7.01,23.95 7.01,24.87 75151-2.1
  Bottom 0.152: v40.16,14.43 v43.81,18.09 | v36.5,11.84 31.32,11.84 31.01,11.53 26.59,11.53 25.45,12.68 U$4.16 25.38,12.68 24.23,11.53 22.33,11.53 21.64,12.22 21.64,13.06 10.82,23.88 8.31,23.88 7.77,23.34 v7.62,23.34
BR4  (via drill 0.35)
  Top 0.152: v42.75,8.56 42.9,8.71 42.9,10.08 47.78,14.96 48.16,14.96 50.52,17.32 50.52,18.85 49.53,19.84 R28.2 | v10.06,27.23 8.31,28.98 8.31,30.96 75151-2.15
  Bottom 0.152: v42.75,8.56 39.7,8.56 37.87,10.39 37.87,11.38 36.58,12.68 30.48,12.68 U$4.20 30.48,12.75 29.34,13.89 23.39,13.89 v10.06,27.23
BUT1
  Top 0.152: 74151-1.13 26.06,30.96 26.06,27.84 27.96,25.93 27.96,23.42 33.3,18.09 33.3,16.48 35.81,13.97 R8.1 35.89,11.07 36.8,10.16 BUT1.4 36.73,10.16 35.2,8.64 35.2,6.96 36.8,5.36 36.8,5.13 BUT1.3
BUT2
  Top 0.152: 74151-1.12 27.36,30.96 27.36,30.51 34.29,23.57 41.68,23.57 41.99,23.88 41.99,26.01 42.9,26.92 47.62,26.92 53.65,20.9 55.47,20.9 55.63,20.75 55.63,17.32 54.18,15.88 50.14,15.88 48.62,14.35 48.62,13.97 R9.1 48.54,13.97 48.54,11.15 47.55,10.16 BUT2.4 47.62,10.16 49.15,8.64 49.15,6.96 47.55,5.36 47.55,5.13 BUT2.3
BUT3  (via drill 0.35)
  Top 0.152: 60.05,9.17 59.44,9.17 58.45,10.16 BUT3.4 | 60.05,9.17 63.93,9.17 67.59,12.83 67.59,13.97 R23.1 | v32.69,17.78 26.75,23.72 26.75,25.93 25.45,27.23 25.45,29.06 24.77,29.74 24.77,30.96 74151-1.14 | 60.05,9.17 60.05,6.96 58.45,5.36 58.45,5.13 BUT3.3
  Bottom 0.152: v32.69,17.78 33.38,17.78 40.92,10.24 40.92,9.7 41.45,9.17 45.03,9.17 47.17,11.3 57.23,11.3 58.37,10.16 BUT3.4
BUTLED1  (via drill 0.35)
  Top 0.152: v42.6,3.91 58.67,3.91 59.44,4.67 59.44,4.83 61.04,6.43 63.78,6.43 70.94,13.59 70.94,18.69 73.08,20.83 73.08,24.56 U1.12
  Bottom 0.152: v42.6,3.91 40.39,3.91 39.4,4.9 BUT1.A
BUTLED2
  Top 0.152: U1.11 72.24,24.56 72.24,24.1 70.33,22.2 66.6,22.2 59.36,14.96 53.26,14.96 49,10.69 49,9.25 49.99,8.25 49.99,4.98 BUT2.A
BUTLED3
  Top 0.152: U1.13 73.84,24.56 73.84,21.13 71.25,18.54 71.25,13.44 63.93,6.12 62.1,6.12 60.96,4.98 BUT3.A
CLK_IN
  Top 0.152: U1.32 70.71,33.25 70.71,35.61 75.51,40.41 80.39,40.41 85.72,45.75 R5.1 85.8,45.82 86.87,46.89 90.98,46.89 91.21,47.12 91.21,47.27 95.63,51.69 95.63,54.89 CLOCK.C
CS1  (via drill 0.35)
  Top 0.152: v73.15,32.03 73.15,28.91 74.6,27.46 74.6,24.64 U1.14 | v60.81,40.72 60.81,41.71 61.34,42.24 MCP4922.3 | v33.68,38.35 33.07,37.74 33.07,36.83 INVERTOR.1
  Bottom 0.152: v73.15,32.03 72.69,32.03 63.17,41.55 61.65,41.55 v60.81,40.72 60.81,40.79 58.67,42.93 51.59,42.93 47.02,38.35 v33.68,38.35
CS2
  Top 0.152: INVERTOR.2 34.29,38.66 33.15,39.8 22.78,39.8 20.8,37.82 20.8,37.36 MCP4922-2.3
DAIN  (via drill 0.35)
  Top 0.152: v76.58,31.27 77.04,31.73 77.72,31.73 U1.24 | v26.67,32.49 25.83,32.49 25.45,32.11 25.45,29.52 25.76,29.21 25.76,27.38 27.28,25.86 27.28,24.87 74151-1.5
  Bottom 0.152: v76.58,31.27 73,31.27 63.02,41.25 62.41,41.25 54.18,33.02 54.18,29.67 53.87,29.36 53.11,29.36 50.83,31.65 27.51,31.65 v26.67,32.49
DBIN  (via drill 0.35)
  Top 0.152: v41.3,3.3 63.17,3.3 70.79,10.92 86.94,10.92 91.67,15.65 91.67,16.48 93.8,18.62 93.8,22.73 93.65,22.88 91.21,22.88 83.21,30.89 77.8,30.89 U1.23 | v9.45,21.51 9.45,21.82 12.04,24.41 12.04,24.87 75151-2.5
  Bottom 0.152: v41.3,3.3 33.76,3.3 30.02,7.04 21.72,7.04 18.97,9.78 18.97,10.69 18.14,11.53 17.22,11.53 16.46,12.29 16.46,14.5 v9.45,21.51
ENOUT1
  Top 0.152: R29.1 54.56,18.16 53.11,18.16 47.7,23.57 45.95,23.57 45.11,24.41 45.11,24.87 74238.6
GND  (via drill 0.35)
  Top 0.61: TRIG3.GND 19.36,52.68 10.67,52.68 TRIG4.GND 10.52,52.38 8.38,50.24 8.38,42.77 MCP6004-TRIG.11 8.23,42.47 8.23,41.71 7.39,40.87 5.87,40.87 2.59,37.59 2.59,28.98 C14.2 2.9,28.98 3.66,28.98 5.03,27.61 5.03,3.07 5.03,2.84 | MCP4922-2.12 20.8,42.55 20.8,43.31 21.57,44.07 25.15,44.07 26.14,43.08 MCP4922-2.8 25.91,42.47 29.64,46.2 C3.2 29.41,46.36 28.35,47.42 28.35,52.6 TRIG2.GND | C12.2 80.39,37.59 83.74,37.59 87.02,34.31 JP2.GND | CLOCK.E 96.55,52.68 96.55,51.08 94.41,48.95 ISP1.6 94.11,48.87 91.21,45.97 90.22,45.97 R7.1 | 38.02,46.51 41.15,46.51 C7.2 41.45,46.51 46.25,46.51 C11.2 46.56,46.58 49.38,49.4 49.38,52.6 CV4.GND 49.68,52.6 58.14,52.6 CV3.GND 58.45,52.6 61.34,49.71 | 38.02,46.51 36.8,46.51 C8.2 | TRIG1.GND 37.41,52.6 37.41,49.94 38.02,49.33 38.02,46.74 38.02,46.51 | MCP6004-V.11 73.91,47.04 73.91,49.94 76.58,52.6 CV1.GND | 66.52,49.71 66.52,51.77 67.36,52.6 CV2.GND | 66.52,49.71 66.52,47.57 MCP4922.8 | 61.34,49.71 61.34,47.57 MCP4922.12 | 66.52,49.71 66.29,49.71 61.57,49.71 61.34,49.71 | 75151-2.8 15.85,24.87 14.63,24.87 75151-2.7 14.48,24.64 14.48,23.27 | R1.1 7.62,18.16 10.67,18.16 12.5,19.99 12.65,19.99 R10.1 12.8,20.3 14.48,21.97 14.48,23.27 | 75151-2.14 9.53,31.04 10.74,31.04 75151-2.13 11.05,31.04 12.04,31.04 75151-2.12 12.12,30.73 v12.12,28.22 | v19.28,19.99 17.83,19.99 R11.1 | v21.57,19.99 R12.1 | v25.98,19.99 27.89,19.99 R13.1 | v14.94,23.27 14.71,23.27 14.48,23.27 | 5.03,2.84 7.62,2.84 R17.1 7.85,2.84 11.43,2.84 R16.1 11.66,2.84 15.24,2.84 R15.1 15.47,2.84 19.05,2.84 R19.1 19.28,2.84 22.86,2.84 R20.1 23.09,2.84 26.67,2.84 R21.1 26.9,2.84 30.48,2.84 R22.1 30.71,3 39.78,3 41.68,4.9 BUT1.1 41.91,5.13 BUT1.2 42.06,10.39 42.06,11.68 44.12,13.74 R56.1 44.2,13.97 44.2,16.56
  Top 0.61: 5.03,2.84 3.81,2.84 R18.1 | 74151-1.7 29.87,24.87 31.09,24.87 74151-1.8 31.39,24.79 31.55,24.79 35.51,20.83 35.51,18.31 35.51,18.09 | 35.51,18.09 38.1,18.09 R25.1 38.33,18.09 41.68,18.09 R26.1 41.91,18.09 42.6,18.09 | 35.51,18.09 34.29,18.09 R24.1 | 43.13,24.87 74238.5 43.97,25.09 43.97,25.78 44.58,26.39 46.86,26.39 47.62,25.63 74238.8 | 43.13,24.87 42.6,24.87 74238.4 | 44.2,16.56 45.72,18.09 R27.1 45.95,18.09 49.53,18.09 R28.1 | 42.6,18.09 43.97,16.71 44.2,16.56 | 43.13,24.87 43.13,24.64 43.13,18.69 42.75,18.31 42.6,18.09 | 68.05,29.82 68.05,28.83 68.35,28.52 69.11,28.52 U1.5 | 68.05,29.82 68.35,30.12 69.11,30.12 U1.3 | 54.52,35.42 52.96,36.98 C10.2 52.96,37.36 52.35,36.75 49.45,36.75 REF.2 49.3,36.45 49.3,35.99 48.69,35.38 47.24,35.38 47.02,35.61 42.82,35.61 41.68,36.75 40.69,36.75 INVERTOR.7 | 54.52,35.42 55.63,34.31 55.63,32.33 54.56,31.27 54.41,31.27 C5.2 54.71,31.04 55.4,30.35 55.4,25.7 58.75,22.35 58.9,22.35 C18.2 59.21,22.2 v60.35,22.2 | 54.52,35.42 54.71,35.61 58.22,39.12 58.45,39.12 C17.2 58.75,39.12 63.48,39.12 65.76,36.83 65.76,32.03 67.82,29.97 68.05,29.82 | U1.21 77.8,29.29 84.05,29.29 91.44,21.89 91.97,21.89 C4.- 91.29,21.67 v91.29,19.46 | C13.2 74.91,21.29 74.75,21.29 73.61,20.14 73.61,16.79 74.22,16.18 GATE.P$3 74.52,16.03 74.83,16.03 76.2,14.66 79.78,14.66 81.38,16.26 81.38,19.15 C9.2 81.46,19.46 84.66,19.46 87.94,16.18 GLIDE1.P$3 | BUT2.1 52.58,5.13 52.58,9.93 BUT2.2 53.19,10.16 56.77,13.74 56.77,13.97 R2.1 57.07,14.12 59.36,14.12 60.43,15.19 63.17,15.19 63.4,15.04 | BUT3.2 63.48,10.16 63.25,10.39 63.25,13.97 R14.1 63.4,14.2 63.4,15.04
  Top 0.61: 63.4,15.04 69.65,21.29 69.8,21.29 C6.2
  Bottom 0.61: TRIG3.GND 19.43,52.68 28.35,52.68 TRIG2.GND 28.65,52.68 37.34,52.68 TRIG1.GND | ISP1.6 94.34,48.95 90.68,52.6 87.78,52.6 CLK_IN.GND 87.71,52.3 87.1,51.69 | 87.1,51.69 87.1,34.31 JP2.GND | CV2.GND 67.44,52.68 76.58,52.68 CV1.GND 76.89,52.45 77.5,51.84 86.87,51.84 87.1,51.69 | v12.12,28.22 12.12,26.39 15.09,23.42 | 15.09,23.42 18.36,20.14 19.05,20.14 v19.28,19.99 v21.57,19.99 21.79,19.99 v25.98,19.99 26.21,19.84 32.23,19.84 BUT1.2 | v14.94,23.27 15.09,23.42 | v91.29,19.46 88.01,16.18 GLIDE1.P$3 | BUT3.1 63.55,5.13 63.55,10.16 BUT3.2 63.78,10.31 68.01,14.54 | 68.01,14.54 69.57,16.1 74.22,16.1 GATE.P$3 | v60.35,22.2 67.82,14.73 68.01,14.54 | BUT1.1 41.91,5.05 45.8,5.05 47.17,3.68 51.13,3.68 52.5,5.05 BUT2.1
MISO
  Top 0.152: U1.16 76.2,24.64 76.2,26.31 73.76,28.75 73.76,29.36 77.57,33.17 87.48,33.17 96.85,42.55 96.85,43.76 ISP1.1
MK0  (via drill 0.35)
  Top 0.152: U$4.2 7.62,12.75 6.63,13.74 6.63,18.85 7.62,19.84 R1.2 7.62,20.07 8.99,20.07 12.65,23.72 12.65,25.86 13.18,26.39 v13.95,26.39 | v25.38,26.39 25.98,25.78 25.98,24.87 74151-1.4
  Bottom 0.152: v13.95,26.39 v25.38,26.39
MK1
  Top 0.152: U$4.6 12.72,12.75 12.72,18.09 R10.2 12.72,18.16 16.46,21.89 16.46,26.92 21.79,32.26 23.93,32.26 24.08,32.11 24.08,29.97 24.77,29.29 74151-1.3
MK2
  Top 0.152: U$4.10 17.83,12.75 17.83,18.09 R11.2 17.91,18.09 18.75,18.09 21.64,20.98 21.64,26.01 21.79,26.16 22.63,26.16 23.47,25.32 23.47,24.87 74151-1.2
MK3
  Top 0.152: U$4.14 22.86,12.75 22.86,18.09 R12.2 22.86,18.16 23.85,19.15 23.85,20.75 22.25,22.35 22.25,24.87 74151-1.1
MK4
  Top 0.152: U$4.18 27.96,12.75 27.96,18.09 R13.2 27.89,18.16 26.9,18.16 25.38,19.69 25.38,21.13 24.16,22.35 24.16,25.93 23.55,26.54 23.55,30.96 74151-1.15
MOSI  (via drill 0.35)
  Top 0.152: v75.51,25.86 75.51,24.64 U1.15 | v30.79,38.58 30.71,38.66 24.16,38.66 23.39,37.9 23.39,37.36 MCP4922-2.5 | v72.31,39.34 66.37,39.34 63.93,41.78 63.93,42.24 MCP4922.5 | v81.99,41.1 87.1,41.1 92.28,46.28 94.34,46.28 ISP1.4
  Bottom 0.152: v75.51,25.86 83.74,25.86 95.4,37.52 95.4,45.29 94.41,46.28 ISP1.4 | v30.79,38.58 31.24,38.58 43.36,50.7 62.64,50.7 72.28,41.06 | 72.28,41.06 72.31,41.02 v72.31,39.34 | v81.99,41.1 72.31,41.1 72.28,41.06
N$1
  Top 0.152: R14.2 61.27,13.97 61.27,10.69 60.96,10.39 BUT3.K
N$2
  pour Bottom: 0,66.35 99.5,66.35 100,65.85 100,0.85 99.5,0.35 0,0.35
N$3
  Top 0.152: MCP6004-TRIG.6 10.82,37.29 12.04,37.29 MCP6004-TRIG.7 12.12,37.36 12.12,40.79 17.98,46.66 17.98,49.25 26.98,58.24 26.98,62.74 28.35,64.11 TRIG2.TIP
N$4
  Top 0.152: MCP6004-TRIG.9 10.82,42.55 12.04,42.55 MCP6004-TRIG.8 12.12,42.55 12.12,43.84 26.67,58.4 26.67,63.96 27.96,65.25 36.27,65.25 37.34,64.19 TRIG1.TIP
N$5
  Top 0.152: MCP6004-TRIG.14 4.5,42.55 5.64,42.55 MCP6004-TRIG.13 5.64,42.62 5.64,59.16 10.59,64.11 TRIG4.TIP
N$6  (via drill 0.35)
  Top 0.152: MCP6004-TRIG.1 4.5,37.29 5.64,37.29 MCP6004-TRIG.2 5.71,37.36 v5.71,39.5
  Bottom 0.152: v5.71,39.5 5.71,46.2 19.36,59.84 19.36,64.11 TRIG3.TIP
N$7
  Top 0.152: MCP6004-V.9 76.5,47.04 77.65,47.04 MCP6004-V.8 77.65,47.12 77.65,52.15 78.03,52.53 78.03,62.74 76.66,64.11 CV1.TIP
N$8
  Top 0.152: R2.2 54.86,13.97 53.65,13.97 50.06,10.39 BUT2.K
N$10
  Top 0.152: U1.7 69.11,27 68.66,27 64.31,31.34 64.31,33.93 Q2.2 64.24,34.01 61.11,37.13 58.52,37.13 C17.1
N$11
  Top 0.152: U1.8 69.11,26.09 65.99,26.09 64.31,24.41 Q2.1 64.24,24.33 58.98,24.33 C18.1
N$17
  Top 0.152: R6.1 95.1,58.47 94.79,58.17 94.79,52.76 CLOCK.B 90.22,48.18 90.22,47.88 R7.2
N$25
  Top 0.152: MCP6004-V.6 76.5,41.78 77.65,41.78 MCP6004-V.7 77.72,41.86 77.72,45.29 78.33,45.9 78.33,63.96 77.04,65.25 50.52,65.25 49.45,64.19 CV4.TIP
N$26
  Top 0.152: R6.2 97,58.55 91.44,64.11 87.78,64.11 CLK_IN.TIP
N$31  (via drill 0.35)
  Top 0.152: MCP6004-V.2 71.32,41.78 70.1,41.78 MCP6004-V.1 70.1,41.86 v70.1,44.3 | v62.1,56.41 62.1,60.45 58.45,64.11 CV3.TIP
  Bottom 0.152: v70.1,44.3 70.1,48.41 v62.1,56.41
N$36
  Top 0.152: MCP6004-V.13 71.32,47.04 70.1,47.04 MCP6004-V.14 70.1,47.12 70.1,61.44 67.44,64.11 CV2.TIP
N$65
  Top 0.152: R56.2 42.22,13.97 42.22,13.21 39.4,10.39 BUT1.K
POT1
  Top 0.152: U1.19 77.8,27.69 78.94,27.69 90.45,16.18 GLIDE1.P$2
POT2  (via drill 0.35)
  Top 0.152: v76.35,30.12 77.72,30.12 U1.22
  Bottom 0.152: v76.35,30.12 72.85,26.62 72.31,26.62 71.86,26.16 71.86,21.06 76.73,16.18 GATE.P$2
RST
  Top 0.152: U1.29 73.08,33.25 73.08,34.92 78.26,40.11 88.09,40.11 93.27,45.29 94.79,45.29 95.78,46.28 95.78,47.8 96.85,48.87 ISP1.5
SCK  (via drill 0.35)
  Top 0.152: v78.64,25.25 77.8,26.09 U1.17 77.72,26.16 77.27,26.16 v74.37,29.06 | v23.47,39.19 22.1,37.82 22.1,37.36 MCP4922-2.4 | v62.71,40.64 62.71,42.24 MCP4922.4
  Bottom 0.152: v78.64,25.25 83.59,25.25 95.78,37.44 95.78,45.21 96.85,46.28 ISP1.3 96.85,46.36 95.78,47.42 95.78,48.95 90.98,53.75 88.16,53.75 84.89,57.02 49.23,57.02 31.39,39.19 v23.47,39.19 | v62.71,40.64 74.3,29.06 v74.37,29.06
T0  (via drill 0.35)
  Top 0.152: v3.81,6.35 3.81,4.83 R18.2 | v54.25,21.97 52.81,23.42 52.81,24.03 48.69,28.14 42.44,28.14 40.01,30.58 40.01,30.96 74238.15
  Bottom 0.152: U$4.1 5.91,8.45 | 5.91,8.45 v3.81,6.35 | v54.25,21.97 54.25,15.72 59.97,10.01 59.97,8.1 60.05,8.03 60.05,5.44 59.44,4.83 59.44,4.67 57.45,2.69 11.66,2.69 5.94,8.41 5.91,8.45
T1  (via drill 0.35)
  Top 0.152: v7.62,7.64 7.62,4.83 R17.2 | v30.56,28.75 34.98,33.17 45.87,33.17 46.94,32.11 46.94,29.9 45.87,28.83 42.22,28.83 41.3,29.74 41.3,30.96 74238.14
  Bottom 0.152: v7.62,7.64 10.13,10.16 U$4.3 10.06,10.16 8.99,11.23 8.99,13.06 7.01,15.04 7.01,25.09 11.28,29.36 12.42,29.36 13.03,28.75 v30.56,28.75
T2  (via drill 0.35)
  Top 0.152: v11.43,8.33 11.43,4.83 R16.2 | v42.52,29.44 42.52,30.96 74238.13 | v21.34,30.28 21.34,25.78 13.87,18.31 13.87,11.3 12.72,10.16 U$4.5
  Bottom 0.152: v11.43,8.33 11.43,8.94 12.65,10.16 U$4.5 | v42.52,29.44 38.41,29.44 37.57,30.28 v21.34,30.28
T3  (via drill 0.35)
  Top 0.152: v15.24,8.33 15.24,4.83 R15.2 | v37.87,25.7 39.32,27.15 39.32,32.03 39.55,32.26 42.98,32.26 43.81,31.42 43.81,31.04 74238.12 | v39.47,13.82 39.47,11.84 38.33,10.69 38.33,8.18 38.48,8.03 38.48,5.44 37.87,4.83 37.87,4.67 37.26,4.06 v32.08,4.06
  Bottom 0.152: U$4.7 v15.24,8.33 19.51,4.06 v32.08,4.06 | v37.87,25.7 37.87,15.42 v39.47,13.82
T4  (via drill 0.35)
  Top 0.152: v19.05,8.33 19.05,4.83 R19.2 19.96,3.83 31.32,3.83 31.47,3.99 31.47,5.51 29.26,7.72 29.26,20.45 27.66,22.05 v27.51,22.05 | v32.16,26.7 38.02,32.56 43.97,32.56 45.03,31.5 45.03,31.04 74238.11
  Bottom 0.152: v19.05,8.33 19.05,8.94 17.83,10.16 U$4.9 | v27.51,22.05 v32.16,26.7
T5  (via drill 0.35)
  Top 0.152: v22.86,7.64 22.86,4.83 R20.2 | v31.47,28.75 35.59,32.87 44.96,32.87 46.33,31.5 46.33,31.04 74238.10 | v21.03,22.05 21.03,20.83 19.2,19 16.92,19 16.61,18.69 16.61,12.14 17.37,11.38 19.05,11.38 20.27,10.16 U$4.11
  Bottom 0.152: v22.86,7.64 20.34,10.16 U$4.11 | v31.47,28.75 24.77,22.05 v21.03,22.05
T6
  Top 0.152: R21.2 26.67,4.83 26.67,6.35 U$4.13 22.86,10.08 21.72,8.94 7.16,8.94 6.02,10.08 6.02,25.63 6.55,26.16 9.91,26.16 11.35,27.61 14.63,27.61 22.02,35 30.1,35 30.33,34.77 44.73,34.77 47.62,31.88 47.62,31.04 74238.9
T7  (1 unrouted)
  Top 0.152: R22.2 30.48,4.83 30.48,5.13 25.45,10.16 U$4.15
TRIG1  (via drill 0.35)
  Top 0.152: v73.69,34.39 73.84,34.24 73.84,33.25 U1.28 | v33.83,44.53 v39.78,44.53 | v11.05,44.53 9.53,43 9.53,42.55 MCP6004-TRIG.10
  Bottom 0.152: v73.69,34.39 70.79,34.39 60.66,44.53 v39.78,44.53 | v11.05,44.53 v33.83,44.53
TRIG2  (via drill 0.35)
  Top 0.152: v70.41,30.89 72.24,32.71 72.24,33.17 U1.30 | v51.59,28.75 45.26,35.08 30.48,35.08 30.25,35.31 19.96,35.31 18.52,33.86 11.96,33.86 9.53,36.3 9.53,37.29 MCP6004-TRIG.5
  Bottom 0.152: v70.41,30.89 68.58,30.89 66.45,28.75 v51.59,28.75
TRIG3  (via drill 0.35)
  Top 0.152: v71.4,35.38 71.4,33.25 U1.31 | v47.62,48.95 42.06,54.51 28.73,54.51 18.82,44.6 18.82,41.33 13.41,35.92 10.36,35.92 10.06,36.22 10.06,38.51 9.91,38.66 7.85,38.66 7.01,37.82 7.01,37.36 MCP6004-TRIG.3
  Bottom 0.152: v71.4,35.38 71.4,35.61 58.06,48.95 v47.62,48.95
TRIG4  (via drill 0.35)
  Top 0.152: v69.11,36.98 69.11,31.8 U1.1 | v34.52,45.14 v40.46,45.14 | v7.54,44.07 7.54,43.08 7.01,42.55 MCP6004-TRIG.12
  Bottom 0.152: v69.11,36.98 68.66,36.98 60.5,45.14 v40.46,45.14 | v34.52,45.14 8.61,45.14 v7.54,44.07
VOUTA
  Top 0.152: MCP6004-V.10 75.13,46.97 75.13,46.51 73.53,44.91 60.96,44.91 58.9,46.97 58.9,47.5 MCP4922.14
VOUTB
  Top 0.152: MCP6004-V.12 72.62,46.97 72.62,46.51 71.32,45.21 64.92,45.21 63.93,46.2 63.93,47.5 MCP4922.10
VOUTC  (via drill 0.35)
  Top 0.152: v72.62,44.3 72.62,41.86 MCP6004-V.3 | v69.49,51.84 69.49,52.07 66.98,54.59 42.44,54.59 40.31,56.72 27.89,56.72 18.29,47.12 18.29,42.55 MCP4922-2.14
  Bottom 0.152: v72.62,44.3 72.62,48.72 v69.49,51.84
VOUTD
  Top 0.152: MCP6004-V.5 75.13,41.78 75.13,40.95 72.92,38.73 64.62,38.73 63.32,40.03 59.36,40.03 59.05,40.34 24.99,40.34 23.39,41.94 23.39,42.47 MCP4922-2.10

### Text on the board
bNames: KeyBoard / Controller | Pure Keys / Dev Board / PCB 3 SMD / GMSN! and / Andy C